# Altium project PREN_Level_Shifter.PrjPcb
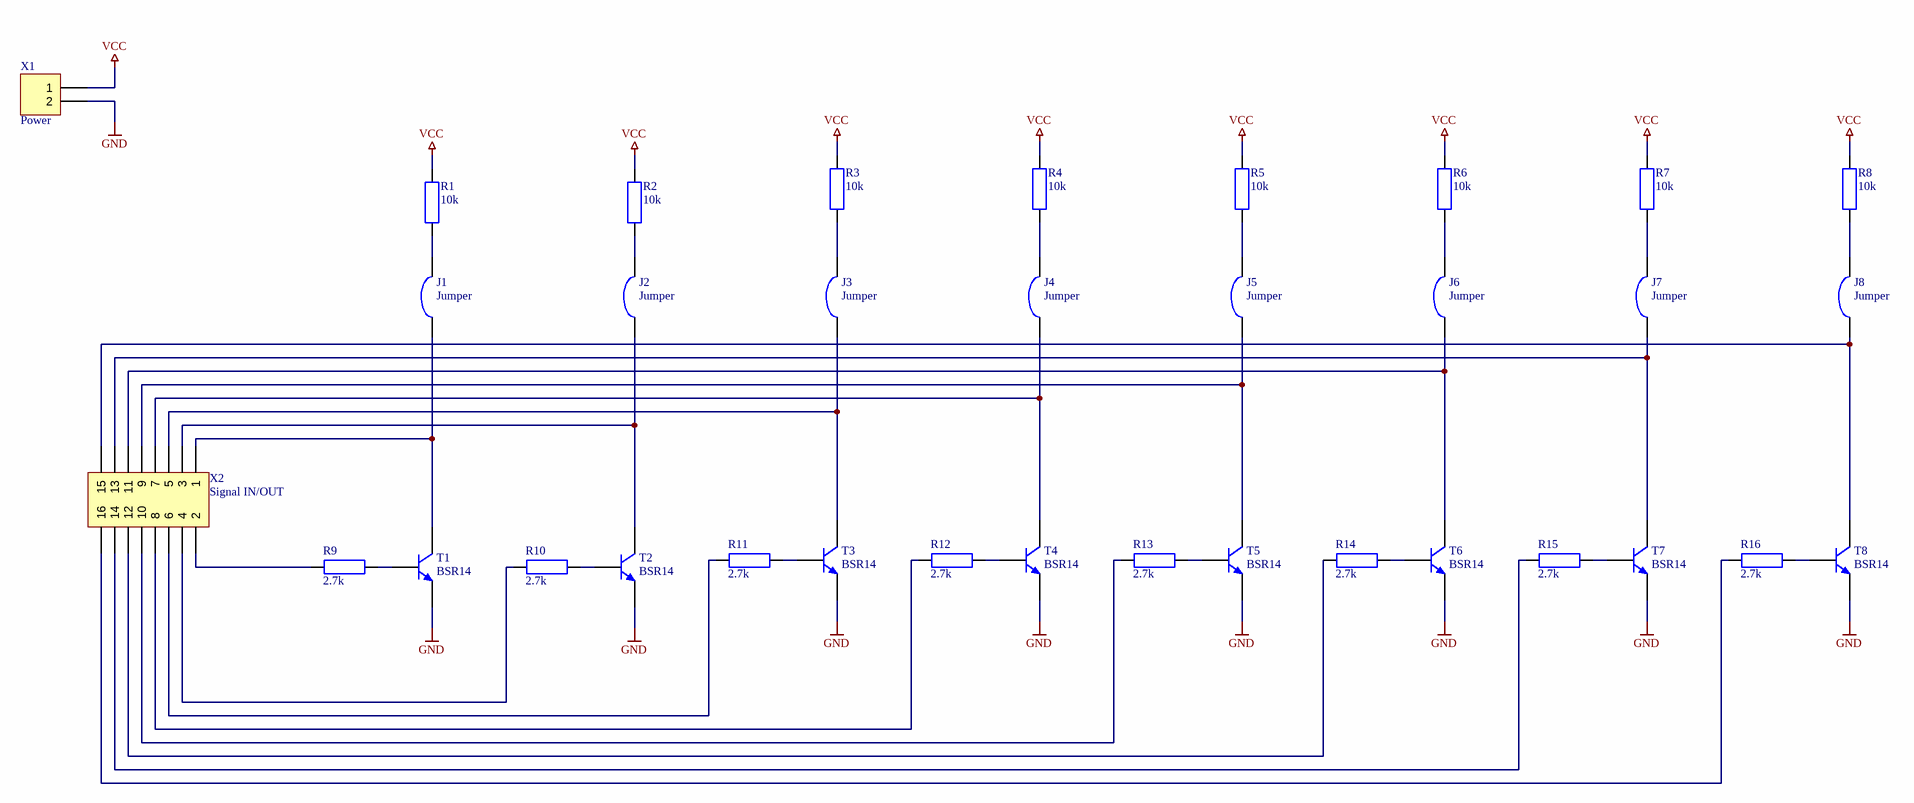
[diagram p0: Level_Shifter.SchDoc]
1 sheet, 34 parts. Net scope: global (net labels, ports and power ports of the same name join across sheets).
Board file: Level_Shifter.PcbDoc

## Sheet Level_Shifter.SchDoc: Level Shifter
size A3; Author: Flavio Kreiliger; DrawnBy: Flavio Kreiliger; Organization: HSLU T&A; Address1: Abteilung Elektrotechnik; Address2: Technikumsstrasse 21; Address3: CH-6048 Horw; SheetNumber: 1; SheetTotal: 1; Projektname: Level_Shifter Pren; ProjectName: Level Shifter

### Parts
J1  Jumper  [Jumper]
J2  Jumper  [Jumper]
J3  Jumper  [Jumper]
J4  Jumper  [Jumper]
J5  Jumper  [Jumper]
J6  Jumper  [Jumper]
J7  Jumper  [Jumper]
J8  Jumper  [Jumper]
R1  10k  [0805]
R2  10k  [0805]
R3  10k  [0805]
R4  10k  [0805]
R5  10k  [0805]
R6  10k  [0805]
R7  10k  [0805]
R8  10k  [0805]
R9  2.7k  [0805]
R10  2.7k  [0805]
R11  2.7k  [0805]
R12  2.7k  [0805]
R13  2.7k  [0805]
R14  2.7k  [0805]
R15  2.7k  [0805]
R16  2.7k  [0805]
T1  BSR14  [SOT-23A_M]
T2  BSR14  [SOT-23A_M]
T3  BSR14  [SOT-23A_M]
T4  BSR14  [SOT-23A_M]
T5  BSR14  [SOT-23A_M]
T6  BSR14  [SOT-23A_M]
T7  BSR14  [SOT-23A_M]
T8  BSR14  [SOT-23A_M]
X1  Power  [HDR1X2]
X2  Signal IN/OUT  [HDR2X8]

### Nets
GND: T1.2(E) T2.2(E) T3.2(E) T4.2(E) T5.2(E) T6.2(E) T7.2(E) T8.2(E) X1.2
VCC: R1.2 R2.2 R3.2 R4.2 R5.2 R6.2 R7.2 R8.2 X1.1
NetJ1_1: J1.1 T1.3(C) X2.1
NetJ1_2: J1.2 R1.1
NetJ2_1: J2.1 T2.3(C) X2.3
NetJ2_2: J2.2 R2.1
NetJ3_1: J3.1 T3.3(C) X2.5
NetJ3_2: J3.2 R3.1
NetJ4_1: J4.1 T4.3(C) X2.7
NetJ4_2: J4.2 R4.1
NetJ5_1: J5.1 T5.3(C) X2.9
NetJ5_2: J5.2 R5.1
NetJ6_1: J6.1 T6.3(C) X2.11
NetJ6_2: J6.2 R6.1
NetJ7_1: J7.1 T7.3(C) X2.13
NetJ7_2: J7.2 R7.1
NetJ8_1: J8.1 T8.3(C) X2.15
NetJ8_2: J8.2 R8.1
NetR9_1: R9.1 X2.2
NetR9_2: R9.2 T1.1(B)
NetR10_1: R10.1 X2.4
NetR10_2: R10.2 T2.1(B)
NetR11_1: R11.1 X2.6
NetR11_2: R11.2 T3.1(B)
NetR12_1: R12.1 X2.8
NetR12_2: R12.2 T4.1(B)
NetR13_1: R13.1 X2.10
NetR13_2: R13.2 T5.1(B)
NetR14_1: R14.1 X2.12
NetR14_2: R14.2 T6.1(B)
NetR15_1: R15.1 X2.14
NetR15_2: R15.2 T7.1(B)
NetR16_1: R16.1 X2.16
NetR16_2: R16.2 T8.1(B)

### Notes on the sheet
- Project:
- Drawn by:
- Size:
- Sheet
- A3
- Rev.:
- of
- Date:
- File:

### Library data of the parts
J1-J8 = Jumper: Wire link
R1-R16 = R?: Normaler Widerstand
T1-T8 = BC817-25: NPN General Purpose Amplifier; Published: 8-Jun-2000; LatestRevisionDate: 20-Nov-2009; LatestRevisionNote: IPC-7351 Footprint Added.; DatasheetVersion: 1997; PackageVersion: Sep-1998; PackageReference: SOT-23A; Publisher: Altium Limited; PackageDescription: 3-Pin SOT-23 Package 0.95 mm Pitch, 2.3 mm Lead Span; ComponentLink1Description: Manufacturer Link; ComponentLink1URL: http://www.fairchildsemi.com/; ComponentLink2Description: Discontinuation Notice; ComponentLink2URL: http://www.fairchildsemi.com/obsolete/obs.jsp
X1 = Header 2: Header, 2-Pin; LatestRevisionDate: 17-Jul-2002; LatestRevisionNote: Re-released for DXP Platform.; Publisher: Altium Limited
X2 = Header 8X2: Header, 8-Pin, Dual row; LatestRevisionDate: 17-Jul-2002; LatestRevisionNote: Re-released for DXP Platform.; Publisher: Altium Limited